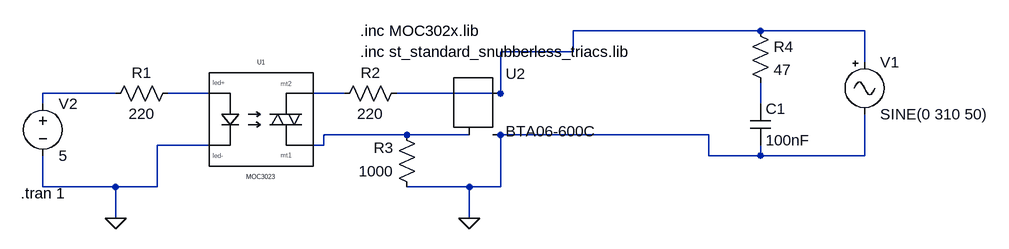
[diagram p0: schematic SHC.asc]
SHC.asc, the LTspice schematic file:
Version 4
SHEET 1 1344 680
WIRE 976 32 688 32
WIRE 1136 32 976 32
WIRE 688 64 688 32
WIRE 688 64 576 64
WIRE 1136 80 1136 32
WIRE -16 128 -128 128
WIRE 128 128 64 128
WIRE 336 128 288 128
WIRE 576 128 576 64
WIRE 576 128 416 128
WIRE -128 144 -128 128
WIRE 976 144 976 112
WIRE 432 192 304 192
WIRE 528 192 432 192
WIRE 896 192 576 192
WIRE 128 208 48 208
WIRE 304 208 304 192
WIRE 304 208 288 208
WIRE 896 224 896 192
WIRE 976 224 976 208
WIRE 976 224 896 224
WIRE 1136 224 1136 160
WIRE 1136 224 976 224
WIRE -128 272 -128 224
WIRE -16 272 -128 272
WIRE 48 272 48 208
WIRE 48 272 -16 272
WIRE 528 272 432 272
WIRE 576 272 576 192
WIRE 576 272 528 272
WIRE -16 320 -16 272
WIRE 528 320 528 272
FLAG -16 320 0
FLAG 528 320 0
SYMBOL LED_TRIAC 176 144 R0
SYMATTR SpiceModel MOC3023
SYMATTR InstName U1
SYMBOL res 80 112 R90
WINDOW 0 0 56 VBottom 2
WINDOW 3 32 56 VTop 2
SYMATTR InstName R1
SYMATTR Value 220
SYMBOL res 432 112 R90
WINDOW 0 0 56 VBottom 2
WINDOW 3 32 56 VTop 2
SYMATTR InstName R2
SYMATTR Value 220
SYMBOL res 448 288 R180
WINDOW 0 36 76 Left 2
WINDOW 3 36 40 Left 2
SYMATTR InstName R3
SYMATTR Value 1000
SYMBOL Misc\\TRIAC 544 128 R0
SYMATTR InstName U2
SYMATTR Value BTA06-600C
SYMBOL voltage -128 128 R0
WINDOW 123 0 0 Left 0
WINDOW 39 0 0 Left 0
SYMATTR InstName V2
SYMATTR Value 5
SYMBOL cap 960 144 R0
SYMATTR InstName C1
SYMATTR Value 100nF
SYMATTR SpiceLine V=400
SYMBOL res 960 16 R0
SYMATTR InstName R4
SYMATTR Value 47
SYMATTR SpiceLine pwr=1
SYMBOL Misc\\signal 1136 64 R0
WINDOW 123 0 0 Left 0
WINDOW 39 0 0 Left 0
SYMATTR InstName V1
SYMATTR Value SINE(0 310 50)
TEXT -162 282 Left 2 !.tran 1
TEXT 360 32 Left 2 !.inc MOC302x.lib
TEXT 360 64 Left 2 !.inc st_standard_snubberless_triacs.lib

The netlist it stands for:
* SHC.asc
XU1 N003 0 N004 N006 MOC3023  ; pins led+ led- mt2 mt1
R1 N003 N002 220
R2 N001 N004 220
R3 0 N006 1000
XU2 N001 N006 0 BTA06-600C  ; pins MT2 G MT1
V2 N002 0 5
C1 N005 0 100nF V=400
R4 N001 N005 47 pwr=1
V1 N001 0 SINE(0 310 50)
.tran 1
.inc MOC302x.lib
.inc st_standard_snubberless_triacs.lib
.backanno
.end